# EAGLE design LHR Mag Sensor Mk2 (EAGLE 9.1.3)
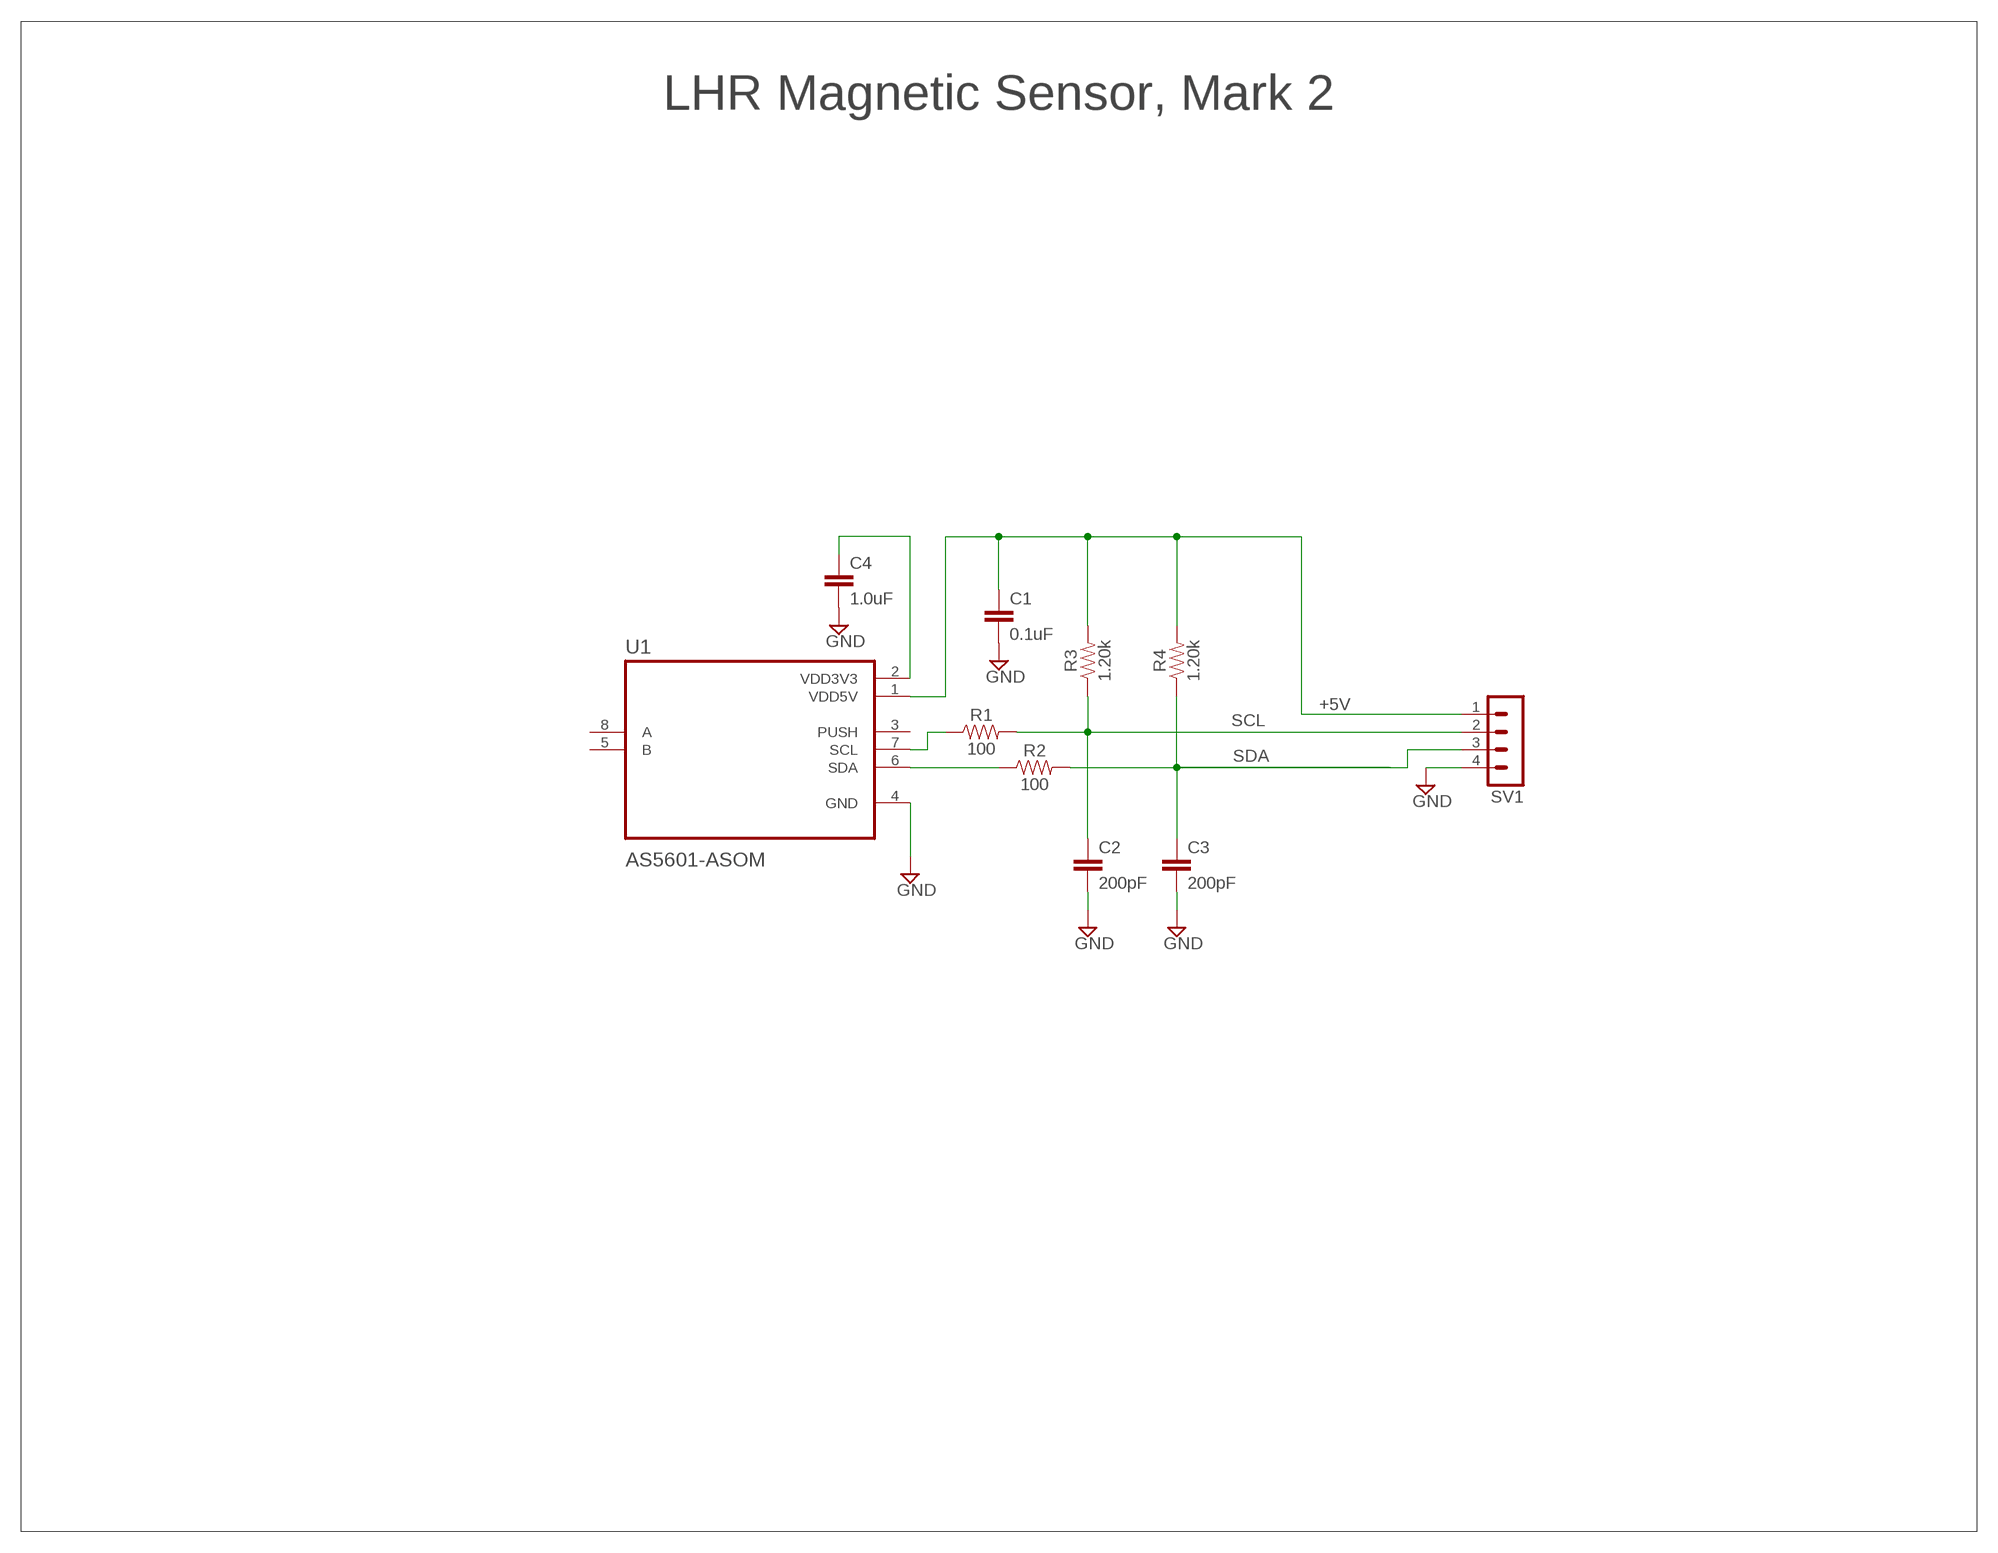
[diagram p0: schematic, sheet 1]

## Parts
C1  0.1uF  22PF-0603-50V-5%  [0603]
C2  200pF  22PF-0603-50V-5%  [0603]
C3  200pF  22PF-0603-50V-5%  [0603]
C4  1.0uF  22PF-0603-50V-5%  [0603]
R1  100  10KOHM-0603-1/10W-1%  [0603]
R2  100  10KOHM-0603-1/10W-1%  [0603]
R3  1.20k  1.20KOHM-0603-1/10W-1%  [0603]
R4  1.20k  1.20KOHM-0603-1/10W-1%  [0603]
SV1  MA04-1  [MA04-1]
U1  AS5601-ASOM  [SOIC127P600X172-8N]

## Nets
+5V: C1.1 R3.2 R4.2 SV1.1 U1.1(VDD5V)
GND: C1.2 C2.2 C3.2 C4.2 SV1.4 U1.4(GND)
N$1: R2.1 U1.6(SDA)
N$2: C4.1 U1.2(VDD3V3)
N$5: R1.1 U1.7(SCL)
SCL: C2.1 R1.2 R3.1 SV1.2
SDA: C3.1 R2.2 R4.1 SV1.3
Unconnected: U1.3(PUSH) U1.5(B) U1.8(A)

## Notes on the sheet
- LHR Magnetic Sensor, Mark 2

## Library data of the parts
C1-C4 = SparkFun-Capacitors:22PF: 22pF ceramic capacitors A capacitor is a passive two-terminal electrical component used to store electrical energy temporarily in an electric field.; PROD_ID: CAP-07876; VALUE: 22pF
R1 R2 = SparkFun-Resistors:10KOHM: 10kΩ resistor A resistor is a passive two-terminal electrical component that implements electrical resistance as a circuit element. Resistors act to reduce current flow, and, at the same time, act to lower voltage levels within circuits. - Wikipedia; PROD_ID: RES-00824; VALUE: 10k
R3 R4 = SparkFun-Resistors:1.20KOHM: 1.20kΩ resistor A resistor is a passive two-terminal electrical component that implements electrical resistance as a circuit element. Resistors act to reduce current flow, and, at the same time, act to lower voltage levels within circuits. - Wikipedia; PROD_ID: RES-08413
SV1 = con-lstb:MA04-1: PIN HEADER; OC_FARNELL: unknown; OC_NEWARK: unknown
U1 = LHR_Parts:AS5601-ASOM: None; AVAILABILITY: Good; DESCRIPTION: Board Mount Hall Effect / Magnetic Sensors SOIC 8; MF: ams; MP: AS5601-ASOM; PACKAGE: SOIC-8 ams; PRICE: 2.99 USD

## Board
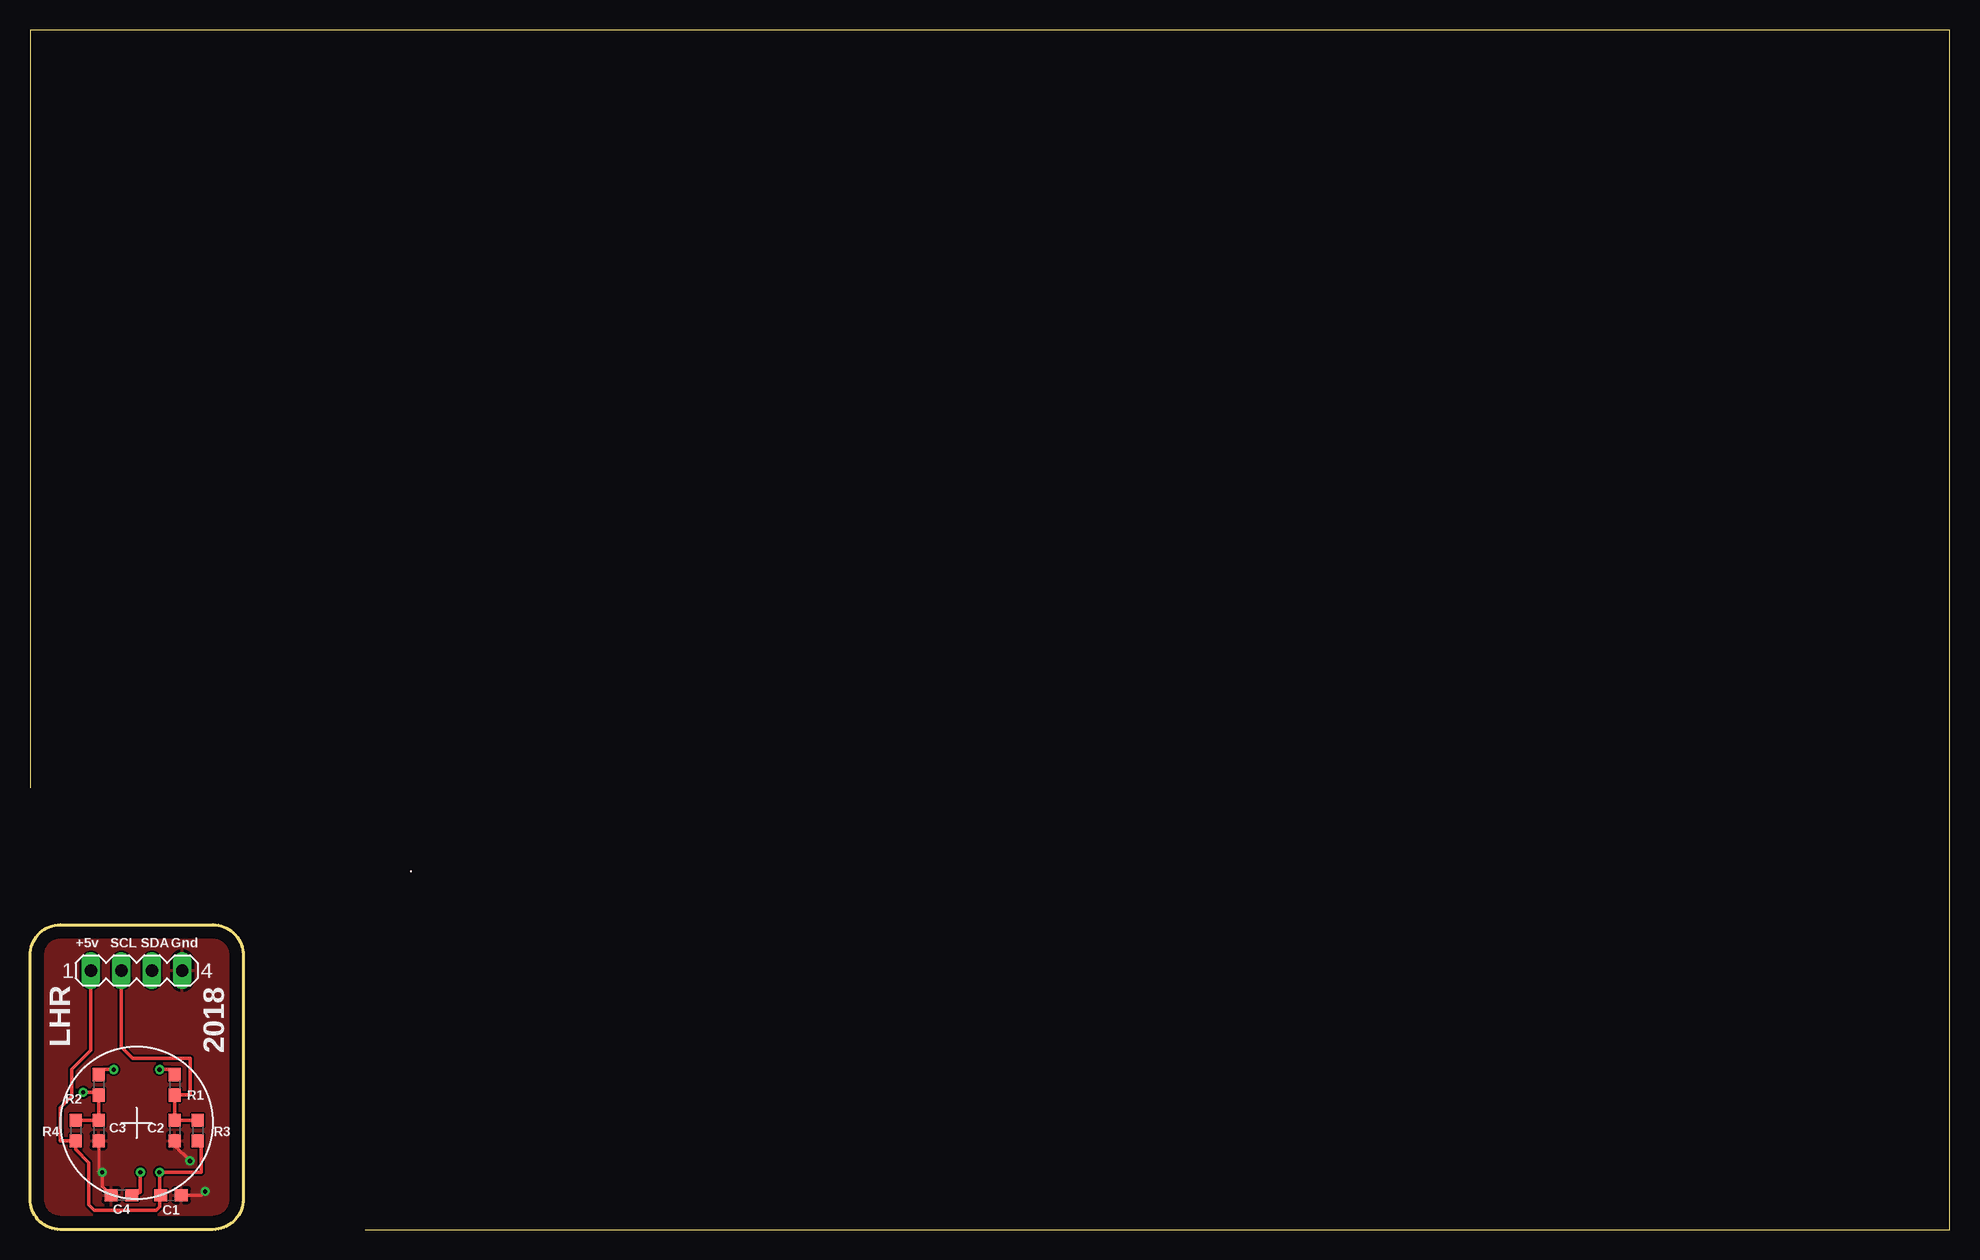
[diagram p1: board, top side]
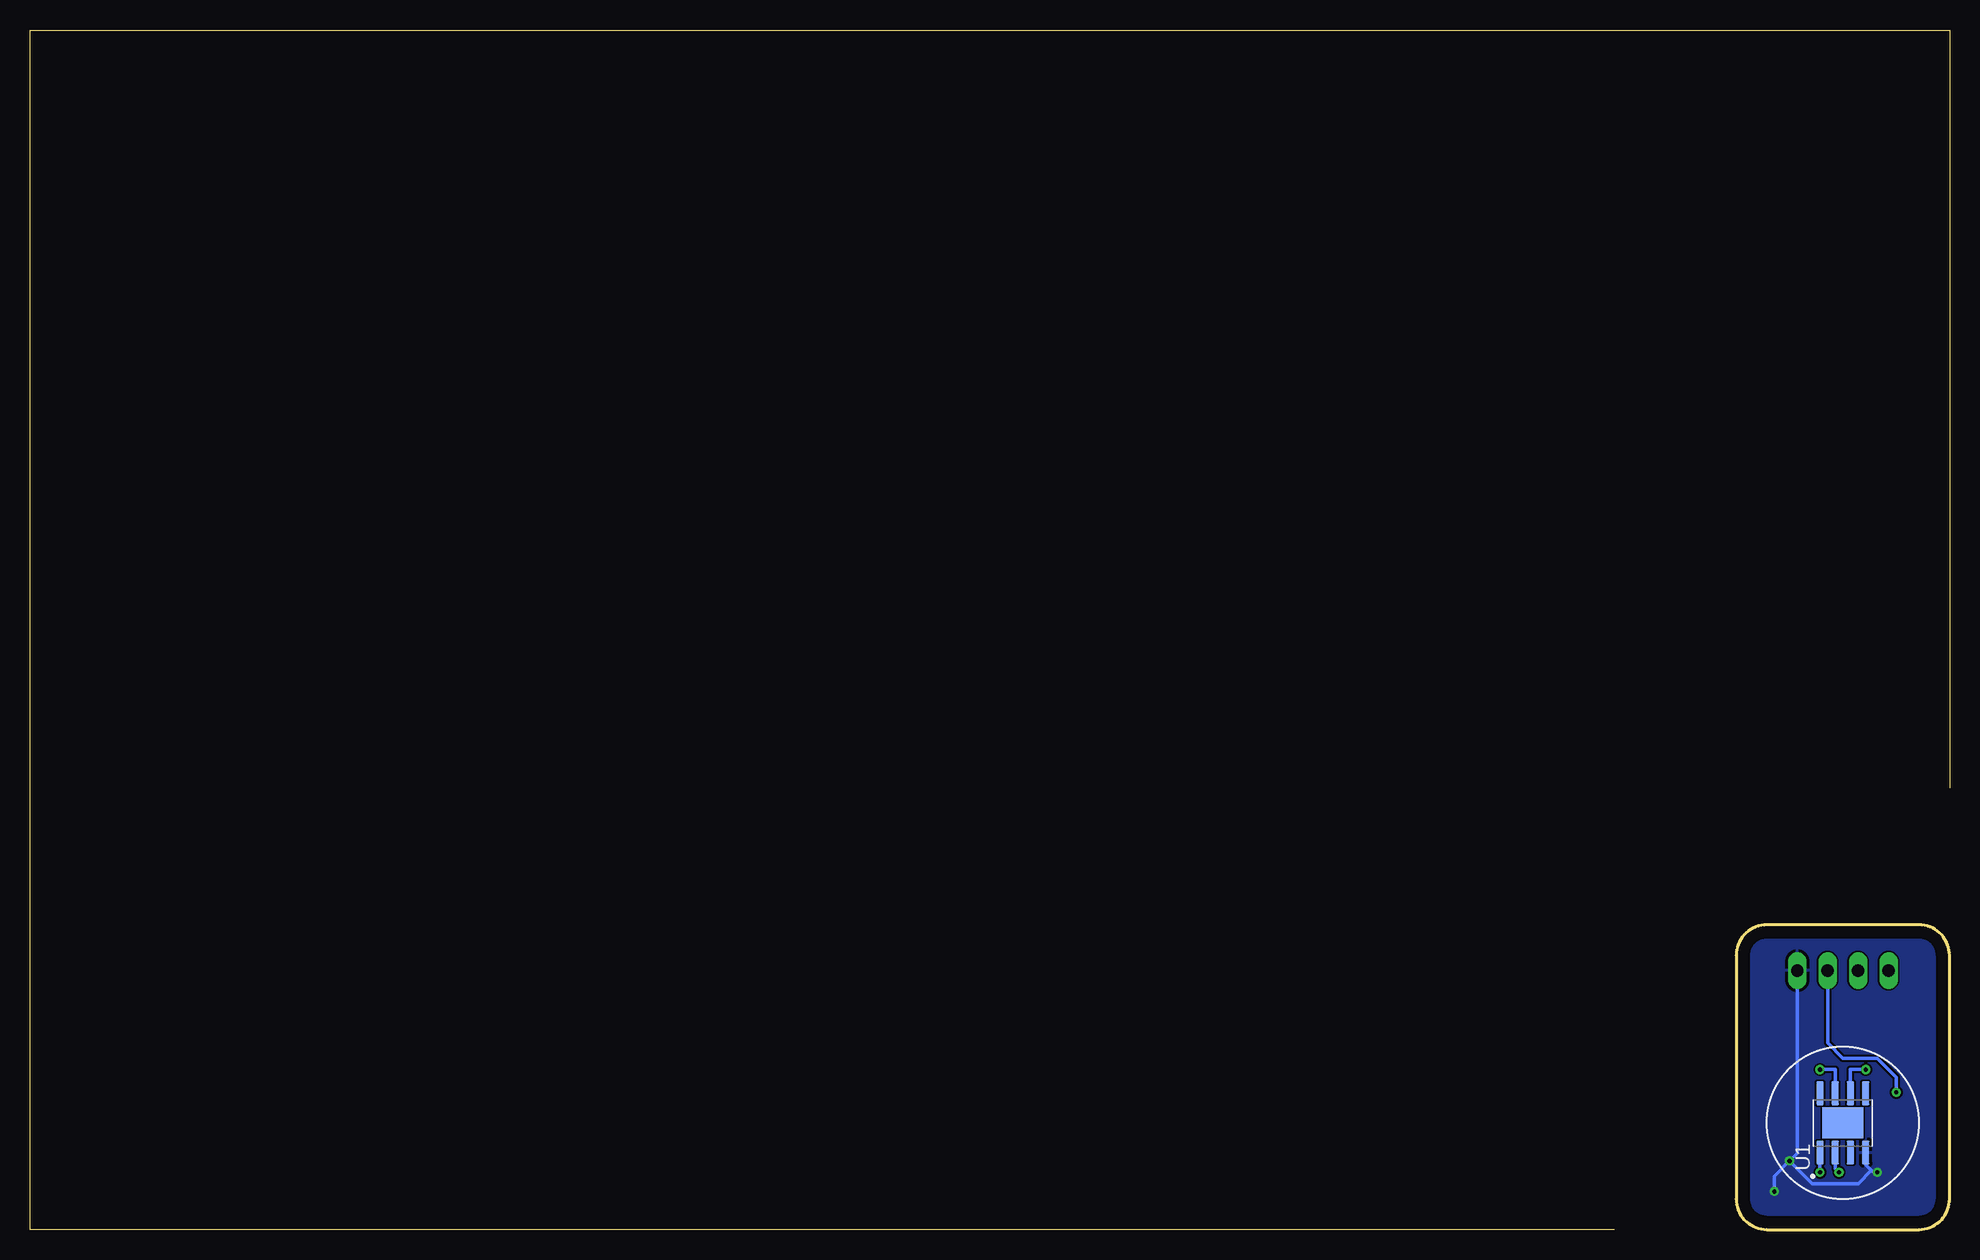
[diagram p2: board, bottom side, seen from below]

Size 160 x 100 mm. Coordinates in mm from the lower left corner, seen from the top.
Outline: 27.94,0 160,0 160,100 0,100 0,36.83
Outline: 0,2.54 0,22.86 arc-90 2.54,25.4 15.24,25.4 arc-90 17.78,22.86 17.78,2.54 arc-90 15.24,0 2.54,0 arc-90 0,2.54
Copper layers (1*16): Top 0.035mm / dielectric 1.5mm / Bottom 0.035mm
Design rules "default": minimum track width 6mil, minimum drill 0.35mm, track to track 6mil, track to pad 6mil, pad to pad 6mil, via to via 6mil, smd to smd 6mil, copper to edge 40mil, drill to drill 6mil, minimum pad ring 10mil, minimum via ring 8mil, stop-mask expansion 4mil, vias tented up to drill 0mil, thermal gap 10mil

### Footprints (pad centres in the part's own frame; a part is rotated, then mirrored left to right if it is on the bottom)
0603 = smd 1.1 x 1: 1 -0.85,0; 2 0.85,0
MA04-1 = drill 1.016 long: 1 -3.81,0; 2 -1.27,0; 3 1.27,0; 4 3.81,0
SOIC127P600X172-8N = smd 1.97 x 0.6: 1 -2.475,1.905; 2 -2.475,0.635; 3 -2.475,-0.635; 4 -2.475,-1.905; 5 2.475,-1.905; 6 2.475,-0.635; 7 2.475,0.635; 8 2.475,1.905 | smd 2.58 x 3.402: 9 0,0

### Placement (x,y rotation side)
C1  11.75,2.86 0 top
C2  12.06,8.26 270 top
C3  5.71,8.26 270 top
C4  7.62,2.86 180 top
R1  12.06,12.06 270 top
R2  5.71,12.06 270 top
R3  13.97,8.26 270 top
R4  3.81,8.26 270 top
SV1  8.89,21.59 0 top
U1  8.89,8.89 90 bottom

### Tracks (layer width: path | path; a pad name or v marks a point on that pad's centre or on a via)
+5V  (via drill 0.35)
  Top 0.305: 10.79,2.86 C1.1 | 10.79,2.86 v10.79,4.76 14.29,4.76 14.29,7.09 R3.2 | 10.79,2.86 10.79,1.91 10.5,1.61 5.37,1.61 4.91,2.08 4.91,5.57 3.81,6.67 R4.2 2.54,7.41 2.54,10.16 3.49,11.11 3.49,13.34 5.08,14.92 5.08,19.05 SV1.1
  Bottom 0.305: v10.79,4.76 U1.1
GND  (via drill 0.35)
  Top 0.152: C3.2 5.93,7.62
  Top 0.254: v6.02,4.76 5.71,4.84 C3.2
  Top 0.305: v6.02,4.76 v6.03,4.76 6.03,3.6 C4.2 | C2.2 12.06,6.99 v13.34,5.71 | v14.61,3.17 14.29,2.86 C1.2
  Bottom 0.305: 6.51,4.92 6.35,4.76 v6.03,4.76 | 6.51,4.92 6.99,5.4 U1.4 | 6.51,4.92 7.62,3.81 11.43,3.81 v13.34,5.71 | v13.34,5.71 14.61,4.45 v14.61,3.17 | SV1.4 12.7,6.35 v13.34,5.71
  pour Top: 0,25.4 17.78,25.4 17.78,0 0,0
  pour Bottom: 0,25.4 17.78,25.4 17.78,0 0,0
N$1  (via drill 0.35)
  Top 0.305: R2.1 6.13,13.34 v6.99,13.34
  Bottom 0.305: v6.99,13.34 8.26,13.34 U1.6
N$2  (via drill 0.35)
  Top 0.305: C4.1 9.21,3.1 v9.21,4.76
  Bottom 0.305: U1.2 9.53,5.08 v9.21,4.76
N$5  (via drill 0.35)
  Top 0.305: R1.1 11.64,13.34 v10.79,13.34
  Bottom 0.305: v10.79,13.34 9.53,13.34 U1.7
SCL
  Top 0.305: R3.1 C2.1 R1.2 | R1.2 12.28,11.43 | SV1.2 7.62,15.24 8.57,14.29 13.34,14.29 13.34,11.21 R1.2
SDA  (via drill 0.35)
  Top 0.305: R4.1 C3.1 R2.2 5.5,11.43 v4.45,11.43
  Bottom 0.305: SV1.3 10.16,15.56 8.89,14.29 6.03,14.29 4.45,12.7 v4.45,11.43

### Text on the board
tNames: +5v | SCL | SDA | Gnd | LHR | 2018